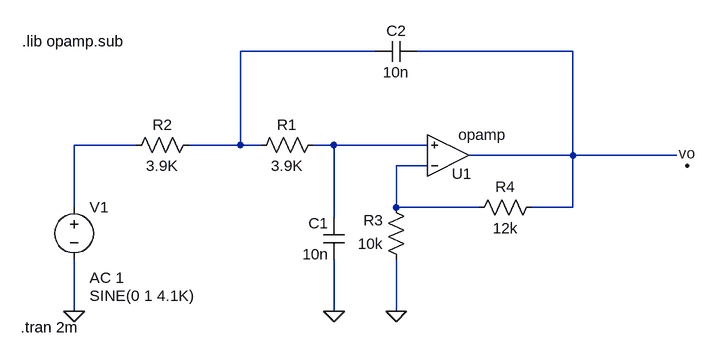
[diagram p0: schematic Filtro_Passa_Baixa_fc_200hz_Prática_III.asc]
Filtro_Passa_Baixa_fc_200hz_Prática_III.asc, the LTspice schematic file:
Version 4
SHEET 1 880 680
WIRE 96 -32 -112 -32
WIRE 400 -32 160 -32
WIRE -272 112 -368 112
WIRE -112 112 -112 -32
WIRE -112 112 -192 112
WIRE -80 112 -112 112
WIRE 32 112 0 112
WIRE 176 112 32 112
WIRE 400 128 400 -32
WIRE 400 128 240 128
WIRE 560 128 400 128
WIRE 176 144 128 144
WIRE -368 208 -368 112
WIRE 128 208 128 144
WIRE 256 208 128 208
WIRE 400 208 400 128
WIRE 400 208 336 208
WIRE 32 224 32 112
WIRE -368 368 -368 288
WIRE 32 368 32 288
WIRE 128 368 128 288
FLAG -368 368 0
FLAG 32 368 0
FLAG 128 368 0
FLAG 576 144 vo
SYMBOL OpAmps\\opamp 208 192 M180
WINDOW 0 6 36 Left 2
SYMATTR InstName U1
SYMBOL cap 48 288 R180
WINDOW 0 24 56 Left 2
WINDOW 3 24 8 Left 2
SYMATTR InstName C1
SYMATTR Value 10n
SYMBOL cap 160 -48 R90
WINDOW 0 0 32 VBottom 2
WINDOW 3 32 32 VTop 2
SYMATTR InstName C2
SYMATTR Value 10n
SYMBOL res 16 96 R90
WINDOW 0 0 56 VBottom 2
WINDOW 3 32 56 VTop 2
SYMATTR InstName R1
SYMATTR Value 3.9K
SYMBOL res 144 304 R180
WINDOW 0 36 76 Left 2
WINDOW 3 36 40 Left 2
SYMATTR InstName R3
SYMATTR Value 10k
SYMBOL res 240 224 R270
WINDOW 0 32 56 VTop 2
WINDOW 3 0 56 VBottom 2
SYMATTR InstName R4
SYMATTR Value 12k
SYMBOL res -176 96 R90
WINDOW 0 0 56 VBottom 2
WINDOW 3 32 56 VTop 2
SYMATTR InstName R2
SYMATTR Value 3.9K
SYMBOL voltage -368 192 R0
WINDOW 3 24 152 Left 2
WINDOW 123 24 124 Left 2
WINDOW 39 0 0 Left 0
SYMATTR InstName V1
SYMATTR Value SINE(0 1 4.1K)
SYMATTR Value2 AC 1
TEXT -448 -48 Left 2 !.lib opamp.sub
TEXT -450 392 Left 2 !.tran 2m

The netlist it stands for:
* Filtro_Passa_Baixa_fc_200hz_Prática_III.asc
XU1 N005 N004 N002 opamp Aol=100K GBW=10Meg  ; pins invin noninvin out
C1 0 N004 10n
C2 N002 N001 10n
R1 N004 N001 3.9K
R3 0 N005 10k
R4 N005 N002 12k
R2 N001 N003 3.9K
V1 N003 0 SINE(0 1 4.1K) AC 1
.lib opamp.sub
.tran 2m
.backanno
.end